# EAGLE design ConnectorBoard (EAGLE 7.2.0)
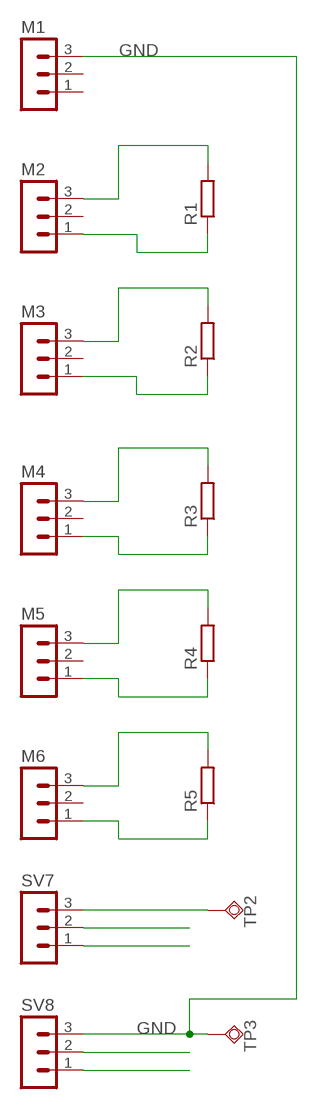
[diagram p0: schematic, sheet 1]

## Parts
M1  MA03-1  [MA03-1]
M2  MA03-1  [MA03-1]
M3  MA03-1  [MA03-1]
M4  MA03-1  [MA03-1]
M5  MA03-1  [MA03-1]
M6  MA03-1  [MA03-1]
R1  R-EU_R0402  [R0402]
R2  R-EU_R0402  [R0402]
R3  R-EU_R0402  [R0402]
R4  R-EU_R0402  [R0402]
R5  R-EU_R0402  [R0402]
SV7  MA03-1  [MA03-1]
SV8  MA03-1  [MA03-1]
TP2  TPSQTP14SQ  [TP14SQ]
TP3  TPSQTP14SQ  [TP14SQ]

## Nets
GND [pwr]: M1.3 SV8.3 TP3.TP
N$1 [pwr]: M3.3 R2.2
N$2: M2.3 R1.2
N$3: M2.1 R1.1
N$4: M3.1 R2.1
N$5: M4.3 R3.2
N$6: M4.1 R3.1
N$7: M5.3 R4.2
N$8: M5.1 R4.1
N$9: SV8.1
N$10: M6.3 R5.2
N$11: M6.1 R5.1
N$12 [pwr]: SV7.3 TP2.TP
N$13: SV8.2
N$14: SV7.2
N$15: SV7.1
Unconnected: M1.1 M1.2 M2.2 M3.2 M4.2 M5.2 M6.2

## Library data of the parts
M1-M6 SV7 SV8 = Fabian:MA03-1: PIN HEADER
R1-R5 = rcl:R-EU_: RESISTOR, European symbol
TP2 TP3 = testpad:TPSQ: Test pad

## Net classes
1 pwr: width 0.4 mm, clearance 0.3 mm

## Board
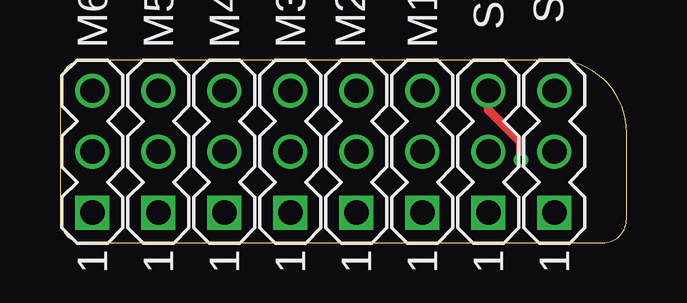
[diagram p1: board, top side]
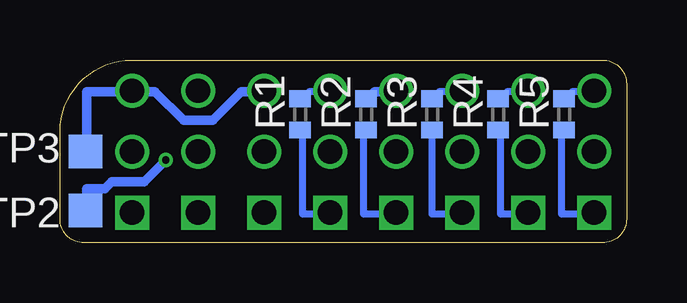
[diagram p2: board, bottom side, seen from below]

Size 23.61 x 7.62 mm. Coordinates in mm from the lower left corner, seen from the top.
Outline: 22.61,0 arc90 23.61,1 23.61,4.62 arc90 20.61,7.62 1,7.62 arc90 0,6.62 0,1 arc90 1,0 22.61,0
Copper layers (1*16): Top 0.035mm / dielectric 1.5mm / Bottom 0.035mm
Design rules "Fischer-LP_BGA *": minimum track width 0.3mm, minimum drill 0.3mm, track to track 0.15mm, track to pad 0.15mm, pad to pad 0.15mm, via to via 0.15mm, smd to smd 0mil, copper to edge 0.2mm, drill to drill 0.3mm, minimum pad ring 0.2mm, minimum via ring 0.15mm, stop-mask expansion 0.05mm, vias tented up to drill 0.5mm, thermal gap 0.15mm

### Footprints (pad centres in the part's own frame; a part is rotated, then mirrored left to right if it is on the bottom)
MA03-1 = drill 1.016 square: 1 -2.54,0 | drill 1.016: 2 0,0; 3 2.54,0
R0402 = smd 0.7 x 0.9: 1 -0.65,0; 2 0.65,0
TP14SQ = smd 1.4 x 1.4: TP 0,0

### Placement (x,y rotation side)
M1  15.1,3.8 90 top
M2  12.35,3.8 90 top
M3  9.6,3.8 90 top
M4  6.85,3.8 90 top
M5  4.1,3.8 90 top
M6  1.35,3.8 90 top
R1  13.6,5.35 90 bottom
R2  10.85,5.35 90 bottom
R3  8.1,5.35 90 bottom
R4  5.35,5.35 90 bottom
R5  2.6,5.35 90 bottom
SV7  17.85,3.8 90 top
SV8  20.6,3.8 90 top
TP2  22.55,1.35 0 bottom
TP3  22.55,3.8 0 bottom

### Tracks (layer width: path | path; a pad name or v marks a point on that pad's centre or on a via)
GND
  Bottom 0.4: M1.3 15.15,6.3 16.05,6.3 17.25,5.1 18.45,5.1 19.65,6.3 20.4,6.3 SV8.3 20.7,6.3 22.5,6.3 22.5,3.9 TP3.TP
N$1
  Bottom 0.4: R2.2 10.8,6 10.5,6.3 9.6,6.3 M3.3
N$2
  Bottom 0.3: R1.2 13.5,6 13.2,6.3 12.45,6.3 M2.3
N$3
  Bottom 0.3: R1.1 13.5,4.65 13.5,1.2 12.45,1.2 M2.1
N$4
  Bottom 0.3: R2.1 10.95,4.65 10.95,1.2 9.6,1.2 M3.1
N$5
  Bottom 0.3: R3.2 7.8,6.3 6.9,6.3 M4.3
N$6
  Bottom 0.3: R3.1 8.1,4.65 8.1,1.2 6.9,1.2 M4.1
N$7
  Bottom 0.3: R4.2 5.25,6 4.95,6.3 4.2,6.3 M5.3
N$8
  Bottom 0.3: R4.1 5.25,4.65 5.25,1.2 4.2,1.2 M5.1
N$10
  Bottom 0.3: R5.2 2.55,6 2.25,6.3 1.35,6.3 M6.3
N$11
  Bottom 0.3: R5.1 2.7,4.65 2.7,1.2 1.35,1.2 M6.1
N$12  (via drill 0.3)
  Top 0.4: v19.2,3.45 19.2,4.2 17.85,5.55 17.85,6.3 SV7.3
  Bottom 0.4: v19.2,3.45 20.1,2.55 21.45,2.55 21.75,2.25 22.5,2.25 22.5,1.35 TP2.TP

### Text on the board
Document: gnd | s2 | gnd | plus | s3 | plus | sig | s4 | s1